# EAGLE design MRF39 (EAGLE 7.2.0)
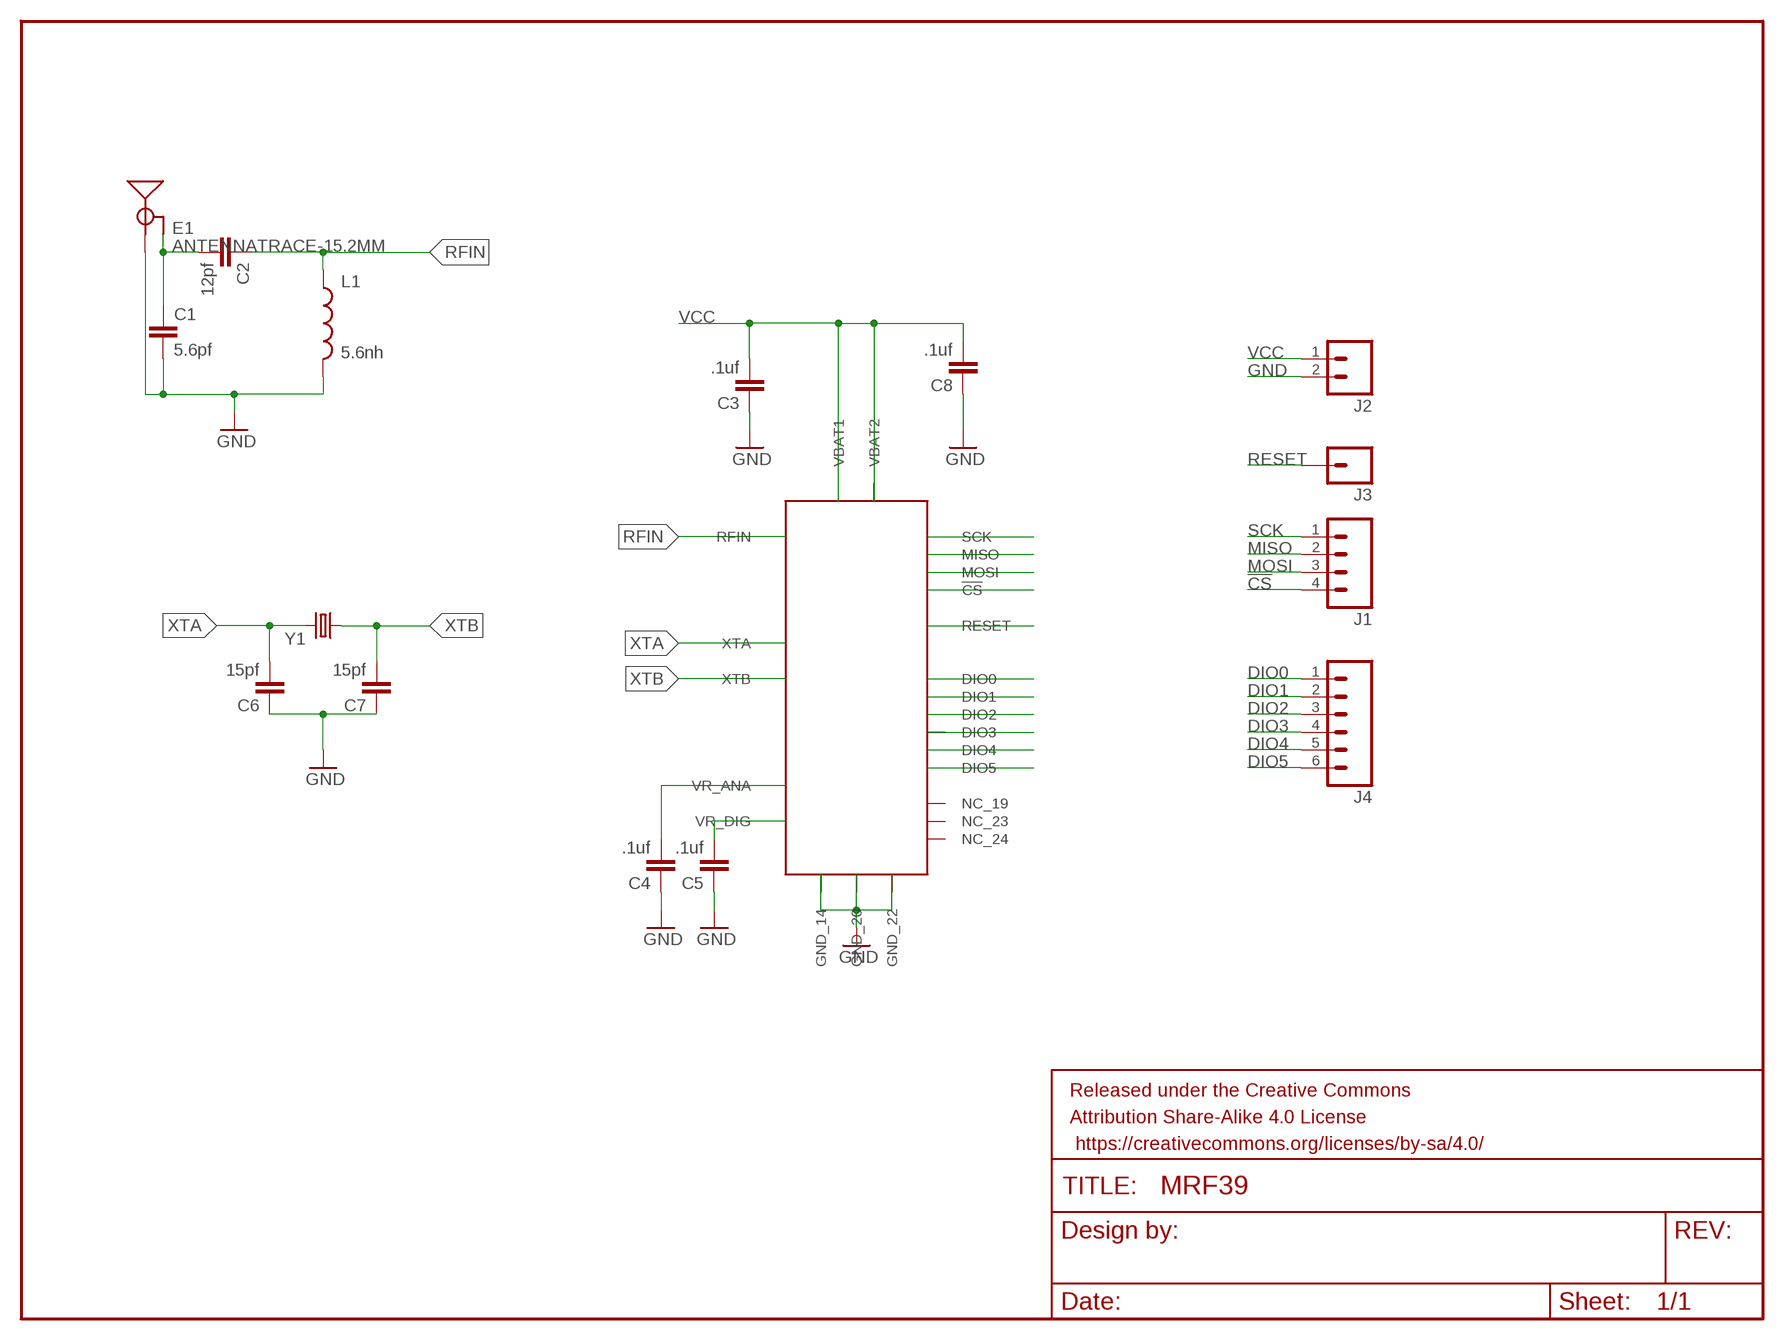
[diagram p0: schematic, sheet 1]

## Parts
C1  5.6pf  CAP0603-CAP  [0603-CAP]
C2  12pf  CAP0603-CAP  [0603-CAP]
C3  .1uf  CAP0603-CAP  [0603-CAP]
C4  .1uf  CAP0603-CAP  [0603-CAP]
C5  .1uf  CAP0603-CAP  [0603-CAP]
C6  15pf  CAP0603-CAP  [0603-CAP]
C7  15pf  CAP0603-CAP  [0603-CAP]
C8  .1uf  CAP0603-CAP  [0603-CAP]
E1  ANTENNATRACE-15.2MM  [TRACE_ANTENNA_2.4GHZ_15.2MM]
FRAME1  FRAME-LETTERNO_PACKAGE  [DUMMY]
J1  M04PTH  [1X04]
J2  M02PTH  [1X02]
J3  M01PTH  [1X01]
J4  M06SILK_FEMALE_PTH  [1X06]
L1  5.6nh  INDUCTOR0805  [0805]
U1  MRF39RATQFN24  [QFN24-5X5X1.0]
Y1  CRYSTALSMD  [HC49UP]

## Nets
!CS: J1.4 U1.18(!CS)
DIO0: J4.1 U1.7(DIO0)
DIO1: J4.2 U1.8(DIO1)
DIO2: J4.3 U1.9(DIO2)
DIO3: J4.4 U1.10(DIO3)
DIO4: J4.5 U1.11(DIO4)
DIO5: J4.6 U1.12(DIO5)
GND: C1.2 C3.1 C4.1 C5.1 C6.1 C7.1 C8.1 E1.ANT(SIGNAL) J2.2 L1.2 U1.14(GND_14) U1.20(GND_20) U1.22(GND_22)
MISO: J1.2 U1.16(MISO)
MOSI: J1.3 U1.17(MOSI)
N$1: C5.2 U1.3(VR_DIG)
N$2: C4.2 U1.2(VR_ANA)
N$3: C1.1 C2.2 E1.GND
RESET: J3.1 U1.6(RESET)
RFIN: C2.1 L1.1 U1.21(RFIN)
SCK: J1.1 U1.15(SCK)
VCC: C3.2 C8.2 J2.1 U1.1(VBAT1) U1.13(VBAT2)
XTA: C6.2 U1.4(XTA) Y1.2
XTB: C7.2 U1.5(XTB) Y1.1
Unconnected: U1.19(NC_19) U1.23(NC_23) U1.24(NC_24)

## Library data of the parts
C1-C8 = SparkFun-Capacitors:CAP: Capacitor Standard 0603 ceramic capacitor, and 0.1" leaded capacitor.
E1 = SparkFun-RF:ANTENNA: Chip antenna Chip antenna with ground or secondary connection. Common with larger metal RF connectors.
FRAME1 = SparkFun-Aesthetics:FRAME-LETTER: Schematic Frame Standard 8.5x11 US Letter frame; DESIGNER: Nobody; VERSION: v01
J1 = SparkFun-Connectors:M04: Header 4 Standard 4-pin 0.1" header. Use with straight break away headers (SKU : PRT-00116), right angle break away headers (PRT-00553), swiss pins (PRT-00743), machine pins (PRT-00117), and female headers (PRT-00115). Molex polarized connector foot print use with SKU : PRT-08231 with associated crimp pins and housings. 1MM SMD Version SKU: PRT-10208; PROD_ID: CONN-09696
J2 = SparkFun-Connectors:M02: Standard 2-pin 0.1" header. Use with - straight break away headers ( PRT-00116) - right angle break away headers (PRT-00553) - swiss pins (PRT-00743) - machine pins (PRT-00117) - female headers (PRT-00115) Molex polarized connector foot print use with: PRT-08233 with associated crimp pins and housings. 2.54_SCREWTERM for use with PRT-10571. 3.5mm Screw Terminal footprints for PRT-08084 5mm Screw Terminal footprints for use with PRT-08432
J3 = SparkFun-Connectors:M01: Header 1 Standard 1-pin 0.1" header. Use with straight break away headers (SKU : PRT-00116), right angle break away headers (PRT-00553), swiss pins (PRT-00743), machine pins (PRT-00117), and female headers (PRT-00115). SMTSO-256-ET is a "flush mount" nut for a 4-40 screw. The older package used to be too tight, and did not allow it to sit properly thru the drill hit. The latest (0.165DIA) fits nice and snug.
J4 = SparkFun-Connectors:M06: Header 6 Standard 6-pin 0.1" header. Use with straight break away headers (SKU : PRT-00116), right angle break away headers (PRT-00553), swiss pins (PRT-00743), machine pins (PRT-00117), and female headers (PRT-00115). Molex polarized connector foot print use with SKU : PRT-08094 with associated crimp pins and housings. NOTES ON THE VARIANTS LOCK and LOCK_LONGPADS... This footprint was designed to help hold the alignment of a through-hole component (i.e. 6-pin header) while soldering it into place. You may notice that each hole has been shifted either up or down by 0.005 of an inch from it's more standard position (which is a perfectly straight line). This slight alteration caused the pins (the squares in the middle) to touch the edges of the holes. Because they are alternating, it causes a "brace" to hold the component in place. 0.005 has proven to be the perfect amount of "off-center" position when using our standard breakaway headers. Although looks a little odd when you look at the bare footprint, once you have a header in there, the alteration is very hard to notice. Also,if you push a header all the way into place, it is covered up entirely on the bottom side. This idea of altering the position of holes to aid alignment will be further integrated into the Sparkfun Library for other footprints. It can help hold any component with 3 or more connection pins.; PROD_ID: CONN-08437
L1 = SparkFun-Passives:INDUCTOR: Inductors Basic Inductor/Choke - 0603 and 1206. Footprints are not proven and vary greatly between part numbers. INDUCTOR POWER 3.3UH 4.0A SMD 0.197" L x 0.197" W x 0.177" H (5.00mm x 5.00mm x 4.50mm)
U1 = Ilan:MRF39RAT: MRF39RAT - Microchip Technology QFN24 5x5x1.0mm RF
Y1 = SparkFun-FreqCtrl:CRYSTAL: Various standard crystals. Proven footprints.

## Board
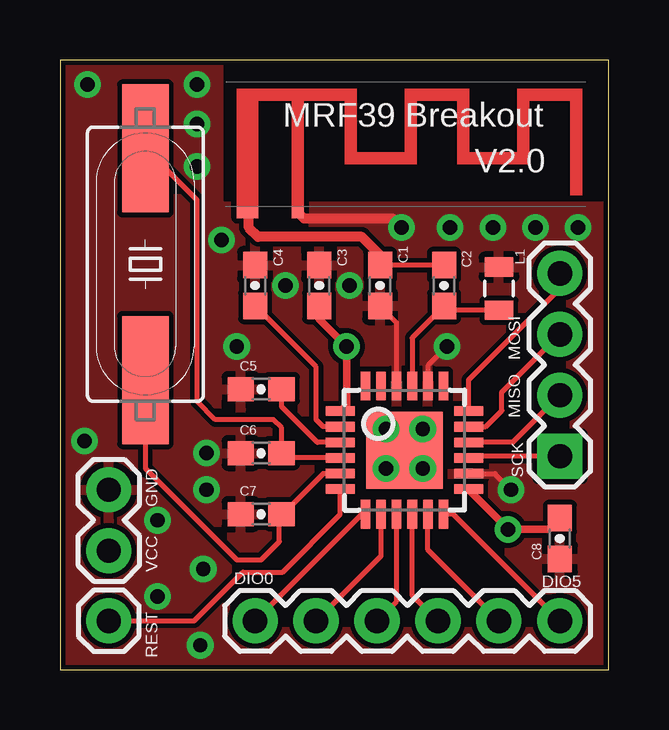
[diagram p1: board, top side]
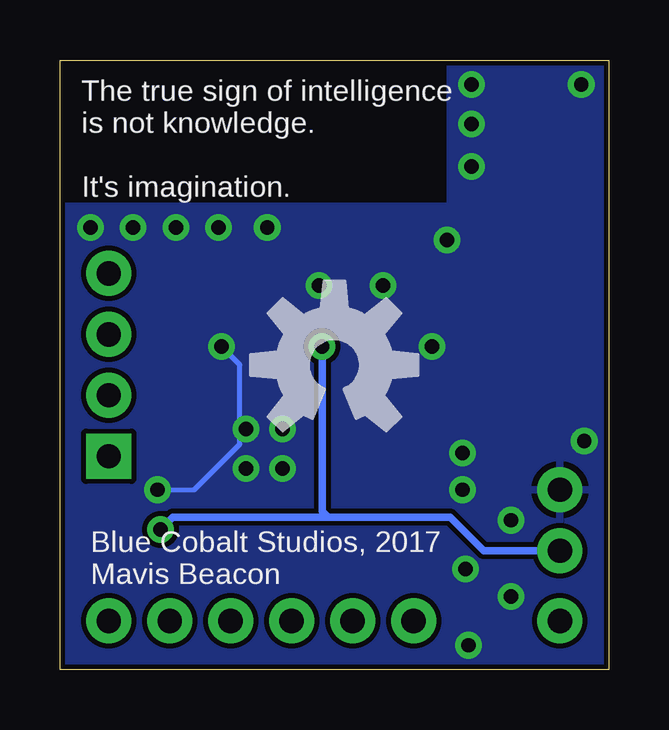
[diagram p2: board, bottom side, seen from below]

Size 22.86 x 25.4 mm. Coordinates in mm from the lower left corner, seen from the top.
Outline: 0,0 22.86,0 22.86,25.4 0,25.4 0,0
Copper layers (1*16): Top 0.035mm / dielectric 1.5mm / Bottom 0.035mm
Design rules "SparkFun *": minimum track width 8mil, minimum drill 20mil, track to track 8mil, track to pad 8mil, pad to pad 8mil, via to via 8mil, smd to smd 8mil, copper to edge 8mil, drill to drill 8mil, minimum pad ring 12mil, minimum via ring 10mil, stop-mask expansion 4mil, vias tented up to drill 25mil, thermal gap 10mil

### Footprints (pad centres in the part's own frame; a part is rotated, then mirrored left to right if it is on the bottom)
0603-CAP = smd 1.1 x 1: 1 -0.85,0; 2 0.85,0
TRACE_ANTENNA_2.4GHZ_15.2MM = smd 0.5 x 0.5: ANT 0,-0.25 | smd 0.9 x 0.5: GND -2.1,-0.25
1X04 = drill 1.016 pad 1.88 square: 1 0,0 | drill 1.016 pad 1.88: 2 2.54,0; 3 5.08,0; 4 7.62,0
1X02 = drill 1.016 pad 1.88: 1 0,0; 2 2.54,0
1X01 = drill 1.016 pad 1.88: 1 0,0
1X06 = drill 1.016 pad 1.88: 1 0,0; 2 2.54,0; 3 5.08,0; 4 7.62,0; 5 10.16,0; 6 12.7,0
0805 = smd 0.8 x 1.2: 1 -0.9,0; 2 0.9,0
QFN24-5X5X1.0 = smd 1.2 x 0.4: 1 -2.675,1.625; 2 -2.675,0.975; 3 -2.675,0.325; 4 -2.675,-0.325; 5 -2.675,-0.975; 6 -2.675,-1.625; 13 2.675,-1.625; 14 2.675,-0.975; 15 2.675,-0.325; 16 2.675,0.325; 17 2.675,0.975; 18 2.675,1.625 | smd 0.4 x 1.2: 7 -1.625,-2.675; 8 -0.975,-2.675; 9 -0.325,-2.675; 10 0.325,-2.675; 11 0.975,-2.675; 12 1.625,-2.675; 19 1.625,2.675; 20 0.975,2.675; 21 0.325,2.675; 22 -0.325,2.675; 23 -0.975,2.675; 24 -1.625,2.675 | smd 3.2 x 3.2: P$1 0,0
HC49UP = smd 5.334 x 1.93: 1 -4.826,0; 2 4.826,0

### Placement (x,y rotation side)
C1  13.34,16 270 top
C2  16,16 90 top
C3  10.79,16 270 top
C4  8.13,16 270 top
C5  8.38,11.68 0 top
C6  8.38,9.02 0 top
C7  8.38,6.48 0 top
C8  20.83,5.46 90 top
E1  9.91,19.3 0 top
FRAME1  7.75,32.77 0 top  (outside the outline)
J1  20.83,8.89 90 top
J2  2.03,4.95 90 top
J3  2.03,2.03 0 top
J4  8.13,2.03 0 top
L1  18.29,15.88 90 top
U1  14.35,9.14 0 top
U$1  [OSHW-LOGO-L]  11.43,12.7 0 bottom
Y1  3.56,16.89 90 top

### Tracks (layer width: path | path; a pad name or v marks a point on that pad's centre or on a via)
!CS
  Top 0.203: U1.18 17.03,12.07 20.83,15.88 J1.4
DIO0
  Top 0.203: J4.1 12.56,6.47 U1.7
DIO1
  Top 0.203: J4.2 13.38,4.74 U1.8
DIO2
  Top 0.203: J4.3 14.03,2.85 U1.9
DIO3
  Top 0.203: J4.4 14.68,3.1 U1.10
DIO4
  Top 0.203: J4.5 15.33,4.99 U1.11
DIO5
  Top 0.203: J4.6 16.39,6.47 U1.12
GND  (via drill 0.6)
  Top 0.203: U1.14 18.12,8.17 v18.8,7.49 | v16.13,13.46 15.33,12.66 U1.20 | U1.22 14.03,14.46 C1.2
  Top 0.406: E1.ANT 10.16,18.8 13.84,18.8 v14.22,18.41
  Bottom 0.203: v18.8,7.49 17.27,7.49 15.37,9.4 15.37,12.7 v16.13,13.46
  other vias: 5.71,24.38 5.71,22.73 5.71,20.95 6.73,17.91 16.26,18.41 18.03,18.41 19.81,18.41 21.59,18.41 9.4,16 12.06,16 6.1,9.02 6.1,7.49 7.37,13.46 5.84,1.02 5.97,4.19 1.02,9.53 1.14,24.38 4.06,3.05 4.06,6.22 15.11,10.03 15.11,8.38 13.59,8.38 13.59,10.03
  pour Bottom: 0,25.4 6.6,25.4 6.6,24.26 6.6,19.3 22.86,19.3 22.86,18.16 22.86,0 0,0 0,1.14
  pour Top: 0.13,25.4 6.6,25.4 6.6,24.51 6.6,19.3 22.86,19.3 22.86,18.41 22.86,0 0,0 0,0.64 0,25.4
MISO
  Top 0.203: J1.2 18.87,9.47 U1.16
MOSI
  Top 0.203: U1.17 17.74,10.12 18.41,10.79 18.41,11.56 J1.3
N$1
  Top 0.203: U1.3 10.72,9.47 9.23,10.96 C5.2
N$2
  Top 0.203: U1.2 10.96,10.12 10.67,10.41 10.67,12.61 C4.2
N$3
  Top 0.203: C2.2 C1.1
  Top 0.406: C1.1 13.34,17.27 12.57,18.03 8.26,18.03 7.87,18.41 7.87,18.99 E1.GND
RESET
  Top 0.203: J3.1 5.59,2.03 7.62,4.06 9.27,4.06 11.68,6.47 U1.6
RFIN
  Top 0.203: L1.1 16.18,14.97 C2.1 14.68,13.83 U1.21
SCK
  Top 0.203: J1.1 17.1,8.89 U1.15
VCC  (via drill 0.6)
  Top 0.203: 20.36,5.84 C8.2 | U1.13 17.03,7.49
  Top 0.305: 20.36,5.84 v18.67,5.84 17.03,7.49 | C3.2 10.79,14.61 v11.94,13.46 11.94,11.03 U1.1
  Bottom 0.305: J2.1 5.21,4.95 6.6,6.35 11.68,6.35 | 11.68,6.35 18.16,6.35 v18.67,5.84 | v11.94,13.46 11.94,6.6 11.68,6.35
XTA
  Top 0.203: U1.4 9.43,8.82 C6.2 9.23,10.07 8.89,10.41 6.48,10.41 5.71,11.18 5.71,19.56 Y1.2
XTB
  Top 0.203: U1.5 10.96,8.17 9.27,6.48 C7.2 9.14,6.39 9.14,5.33 8.38,4.57 7.37,4.57 3.56,8.38 Y1.1

### Text on the board
tPlace: MRF39 Breakout | V2.0 | MOSI | MISO | GND | SCK | VCC | DIO0 | DIO5 | REST
bPlace: The true sign of intelligence / is not knowledge. / / It's imagination. | Blue Cobalt Studios, 2017 / Mavis Beacon